# Altium project AttenuatorProto.PrjPCB
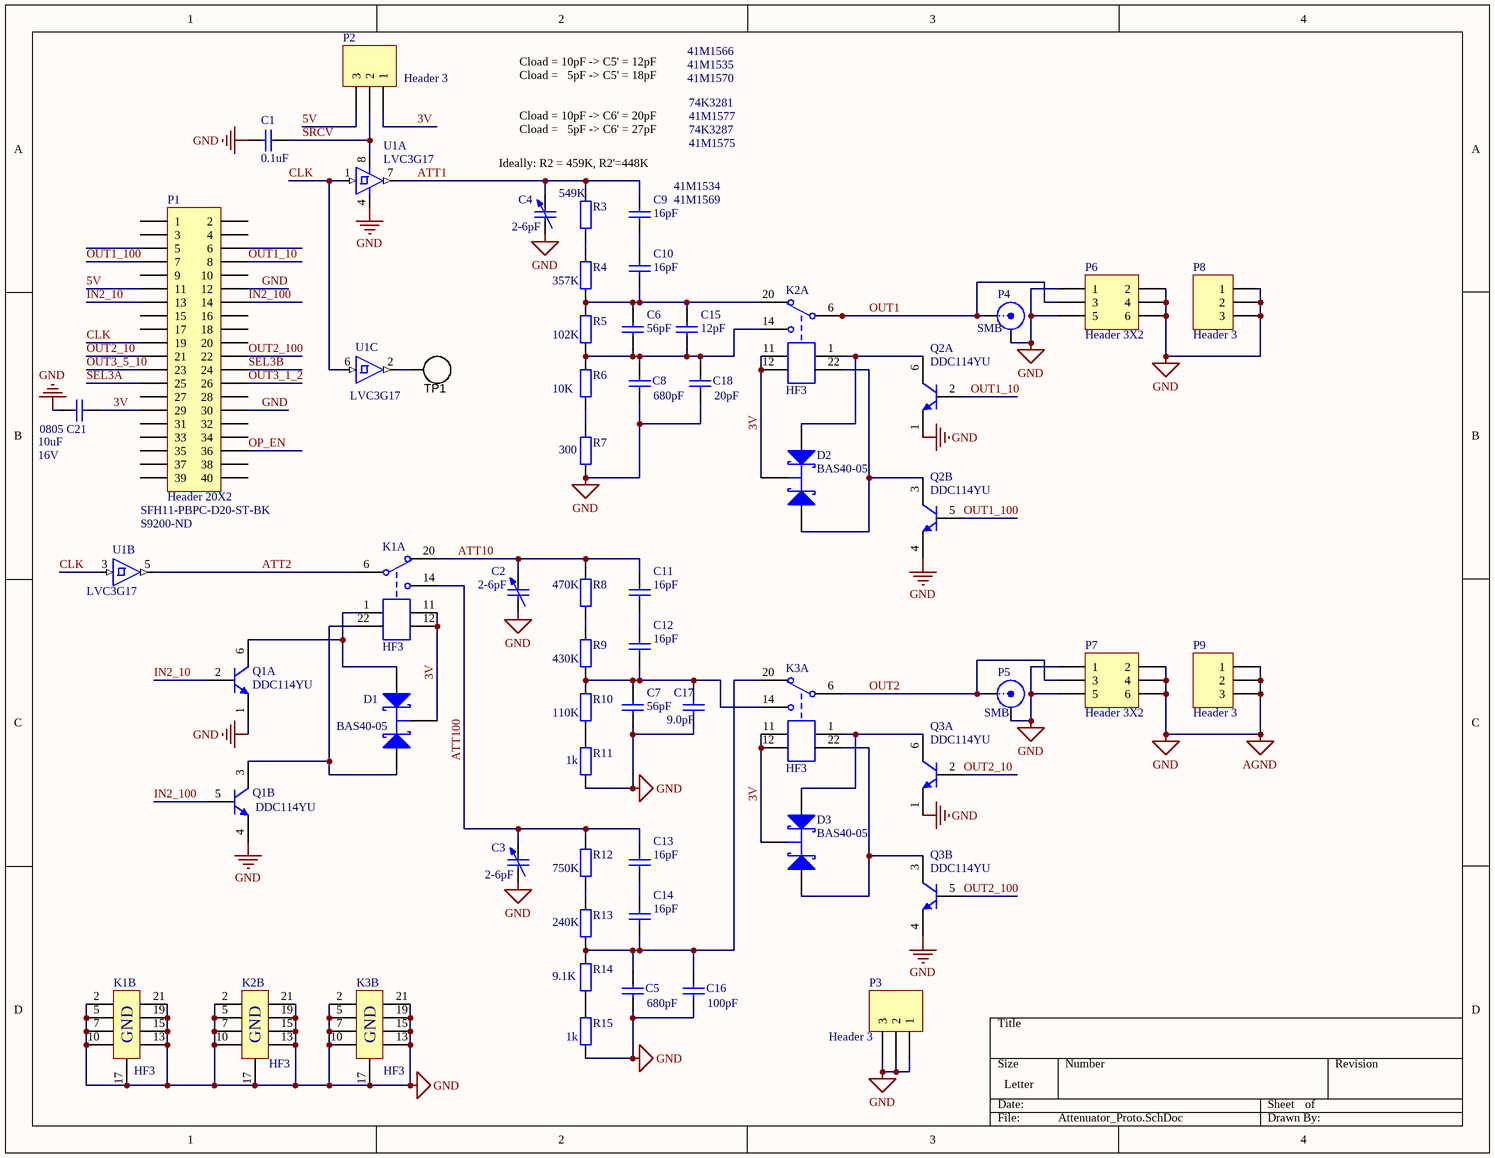
[diagram p0: Attenuator_Proto.SchDoc]
2 sheets, 101 parts. Net scope: global (net labels, ports and power ports of the same name join across sheets).
Board file: Attenuator_Proto.PcbDoc
Sheets:
  Attenuator_Proto.SchDoc
  Att_steet_1.SchDoc

## Sheet Attenuator_Proto.SchDoc
size Letter; DocumentNumber: 1; SheetNumber: 1; SheetTotal: 2

### Parts
C1  value 0.1uF  [C0805]  (hidden comment: Cap)
C2  value 2-6pF  [CAPC3225N]  (hidden comment: Cap Var)
C3  value 2-6pF  [CAPC3225N]  (hidden comment: Cap Var)
C4  value 2-6pF  [CAPC3225N]  (hidden comment: Cap Var)
C5  value 680pF  [c0805]  (hidden comment: Cap)
C6  value 56pF  [c0805]  (hidden comment: Cap)
C7  value 56pF  [c0805]  (hidden comment: Cap)
C8  value 680pF  [c0805]  (hidden comment: Cap)
C9  value 16pF  Supplier Part Number 1: 41M1569  Supplier Part Number 2: 41M1534  [c0805]  (hidden comment: Cap)
C10  value 16pF  [c0805]  (hidden comment: Cap)
C11  value 16pF  [c0805]  (hidden comment: Cap)
C12  value 16pF  [c0805]  (hidden comment: Cap)
C13  value 16pF  [c0805]  (hidden comment: Cap)
C14  value 16pF  [c0805]  (hidden comment: Cap)
C15  value 12pF  Supplier Part Number 2: 41M1570  Supplier Part Number 1: 41M1535  Supplier Part Number 3: 41M1566  [c0805]  (hidden comment: Cap)
C16  value 100pF  [c0805]  (hidden comment: Cap)
C17  value 9.0pF  [c0805]  (hidden comment: Cap)
C18  value 20pF  Supplier Part Number 1: 41M1575  Supplier Part Number 2: 74K3287  Supplier Part Number 3: 41M1577  Supplier Part Number 4: 74K3281  [c0805]  (hidden comment: Cap)
C21  value 10uF  PackageReference: 0805  Voltage: 16V  [CAPC2512L]  (hidden comment: Cap Semi)
D1  BAS40-05  [SOT-23]
D2  BAS40-05  [SOT-23]
D3  BAS40-05  [SOT-23]
K1  PartNumber: HF3  [HF3-75_Ohm]  (hidden comment: HF3_2coils_latching)  (parts A,B of 2)
K2  PartNumber: HF3  [HF3-75_Ohm]  (hidden comment: HF3_2coils_latching)  (parts A,B of 2)
K3  PartNumber: HF3  [HF3-75_Ohm]  (hidden comment: HF3_2coils_latching)  (parts A,B of 2)
P1  Header 20X2  PartNumber: SFH11-PBPC-D20-ST-BK  Supplier Part Number 1: S9200-ND  [HDR2X20]
P2  Header 3  [HDR1X3]
P3  Header 3  [HDR1X3]
P4  SMB  [SMB_V-RJ45]
P5  SMB  [SMB_V-RJ45]
P6  Header 3X2  [HDR2X3]
P7  Header 3X2  [HDR2X3]
P8  Header 3  [HDR1X3]
P9  Header 3  [HDR1X3]
Q1  PartNumber: DDC114YU  [SOT-363]  (hidden comment: DDCxxxxU)  (parts A,B of 2)
Q2  PartNumber: DDC114YU  [SOT-363]  (hidden comment: DDCxxxxU)  (parts A,B of 2)
Q3  PartNumber: DDC114YU  [SOT-363]  (hidden comment: DDCxxxxU)  (parts A,B of 2)
R3  value 549K  [0805]  (hidden comment: Res2)
R4  value 357K  [0805]  (hidden comment: Res2)
R5  value 102K  [0805]  (hidden comment: Res2)
R6  value 10K  [0805]  (hidden comment: Res2)
R7  value 300  [0805]  (hidden comment: Res2)
R8  value 470K  [0805]  (hidden comment: Res2)
R9  value 430K  [0805]  (hidden comment: Res2)
R10  value 110K  [0805]  (hidden comment: Res2)
R11  value 1k  [0805]  (hidden comment: Res2)
R12  value 750K  [0805]  (hidden comment: Res2)
R13  value 240K  [0805]  (hidden comment: Res2)
R14  value 9.1K  [0805]  (hidden comment: Res2)
R15  value 1k  [0805]  (hidden comment: Res2)
TP1  TESTPOINT  [TESTPOINT]  (value not drawn)  (no BOM)
U1  value LVC3G17  [sm8]  (hidden comment: SN74LVC3G17DCTR)  (parts A,B,C of 3)

### Nets
GND: C1.2 C2.1 C3.1 C4.1 C5.1 C7.1 C8.1 C16.1 C17.1 C18.1 C21.2 K1.2(GND) K1.5(GND) K1.7(GND) K1.10(GND) K1.13(GND) K1.15(GND) K1.17(GND) K1.19(GND) K1.21(GND) K2.2(GND) K2.5(GND) K2.7(GND) K2.10(GND) K2.13(GND) K2.15(GND) K2.17(GND) K2.19(GND) K2.21(GND) K3.2(GND) K3.5(GND) K3.7(GND) K3.10(GND) K3.13(GND) K3.15(GND) K3.17(GND) K3.19(GND) K3.21(GND) P1.12 P1.30 P3.1 P3.2 P3.3 P4.2(Y) P5.2(Y) P6.1 P6.2 P6.4 P6.5 P6.6 P7.1 P7.2 P7.4 P7.5 P7.6 P8.1 P8.2 P8.3 P9.1 P9.2 P9.3 Q1.1(E) Q1.4(E) Q2.1(E) Q2.4(E) Q3.1(E) Q3.4(E) R7.1 R11.1 R15.1 U1.4(GND)  [also labelled AGND]
3V: C21.1 D1.3(K) D2.3(K) D3.3(K) K1.11 K1.12 K2.11 K2.12 K3.11 K3.12 P1.29 P2.1
5V: P1.11 P2.3
ATT1: C4.2 C9.2 R3.2 U1.7(1Y)
ATT2: K1.6 U1.5(2Y)
ATT10: C2.2 C11.2 K1.20 R8.2
ATT100: C3.2 C13.2 K1.14 R12.2
CLK: P1.19 U1.1(1A) U1.3(2A) U1.6(3A)
IN2_10: P1.13 Q1.2(B)
IN2_100: P1.14 Q1.5(B)
OP_EN: P1.36
OUT1: K2.6 P4.1(X) P6.3
OUT1_10: P1.8 Q2.2(B)
OUT1_100: P1.7 Q2.5(B)
OUT2: K3.6 P5.1(X) P7.3
OUT2_10: P1.21 Q3.2(B)
OUT2_100: P1.22 Q3.5(B)
OUT3_1_2: P1.26
OUT3_5_10: P1.23
SEL3A: P1.25
SEL3B: P1.24
SRCV: C1.1 P2.2 U1.8(VCC)
NetC5_2: C5.2 C14.1 C16.2 K3.20 R13.1 R14.2
NetC6_1: C6.1 C8.2 C15.1 C18.2 K2.14 R5.1 R6.2
NetC6_2: C6.2 C10.1 C15.2 K2.20 R4.1 R5.2
NetC7_2: C7.2 C12.1 C17.2 K3.14 R9.1 R10.2
NetC9_1: C9.1 C10.2
NetC11_1: C11.1 C12.2
NetC13_1: C13.1 C14.2
NetD1_1: D1.1(A1) K1.1 Q1.6(C)
NetD1_2: D1.2(A2) K1.22 Q1.3(C)
NetD2_1: D2.1(A1) K2.1 Q2.6(C)
NetD2_2: D2.2(A2) K2.22 Q2.3(C)
NetD3_1: D3.1(A1) K3.1 Q3.6(C)
NetD3_2: D3.2(A2) K3.22 Q3.3(C)
NetR3_1: R3.1 R4.2
NetR6_1: R6.1 R7.2
NetR8_1: R8.1 R9.2
NetR10_1: R10.1 R11.2
NetR12_1: R12.1 R13.2
NetR14_1: R14.1 R15.2
NetTP1_1: TP1.1 U1.2(3Y)

Not connected (* = marked no-connect by the designer): P1 1 2 3 4 5 6 9 10 15 16 17 18 20 27 28 31 32 33 34 35 37 38 39 40

### Notes on the sheet
- Cload = 10pF -> C5' = 12pF
  Cload =   5pF -> C5' = 18pF
- Ideally: R2 = 459K, R2'=448K
- Cload = 10pF -> C6' = 20pF
  Cload =   5pF -> C6' = 27pF

### Library data of the parts
C1 C5-C18 = Cap: Capacitor; Published: 8-Jun-2000; LatestRevisionDate: 17-Jul-2002; LatestRevisionNote: Re-released for DXP Platform.; PackageReference: RAD-0.3; Publisher: Altium Limited
  C1: Supplier 1: Newark; Supplier Part Number 1: 06R3744
  C5 C8: Supplier 1: Newark; Supplier Part Number 1: 46WX121
  C6 C7: Supplier 1: Newark; Supplier Part Number 1: 41M1546
  C9: Supplier 1: Newark; Supplier 2: Newark
  C10-C14: Supplier 1: Newark; Supplier Part Number 1: 41M1569; Supplier 2: Newark; Supplier Part Number 2: 41M1534
  C15: Supplier 1: Newark; Supplier 2: Newark; Supplier 3: Newark
  C18: Supplier 1: Newark; Supplier 2: Newark; Supplier 3: Newark; Supplier 4: Newark
C2-C4 = Cap Var: Variable or Adjustable Capacitor; Published: 24-Mar-1999; LatestRevisionDate: 29-May-2009; LatestRevisionNote: IPC-7351 Footprint Added.; PackageReference: C1210; Publisher: Altium Limited; PackageDescription: Chip Capacitor 1210 Case Size; Code_JEITA: 1210; Code_IPC: CAPC3225; Supplier 1: Digi-Key; Supplier Part Number 1: 490-2001-1-ND
C21 = Cap Semi: Capacitor (Semiconductor SIM Model); Manufacturer: Murata; PartNumber: GRM21BF51C106ZE15L; Published: 8-Jun-2000; LatestRevisionDate: 29-May-2009; LatestRevisionNote: IPC-7351 Footprint Added.; Publisher: Altium Limited; PackageDescription: Chip Capacitor; RoHS: Yes; CompType: Cap; Supplier 1: Digi-Key; Supplier Part Number 1: 490-3347-1-ND
D1-D3 = BAS40-05: Silicon AF Schottky Diode for High-Speed Switching; Published: 21-Mar-2003; DatasheetDocument: Oct-1999; PackageDocument: Sep-2001; PackageReference: SOT-23; Publisher: Altium Limited; ComponentLink1Description: Manufacturer Link; ComponentLink1URL: http://www.infineon.com/; ComponentLink2Description: Datasheet; ComponentLink2URL: http://www.infineon.com/upload/Document/cmc_upload/documents/037/109/bas40_bas140series.pdf
K1-K3 = HF3_2coils_latching: HF3 Relay, Latching type, 2 coils; Manufacturer: Tyco Electronics
P1 = Header 20X2: Header, 20-Pin, Dual row; LatestRevisionDate: 17-Jul-2002; LatestRevisionNote: Re-released for DXP Platform.; Publisher: Altium Limited; Supplier 1: Digi-Key
P2 P3 P8 P9 = Header 3: Header, 3-Pin; LatestRevisionDate: 17-Jul-2002; LatestRevisionNote: Re-released for DXP Platform.; Publisher: Altium Limited
P4 P5 = SMB: SMB Straight Connector; LatestRevisionDate: 17-Jul-2002; LatestRevisionNote: Re-released for DXP Platform.; Publisher: Altium Limited
P6 P7 = Header 3X2: Header, 3-Pin, Dual row; LatestRevisionDate: 17-Jul-2002; LatestRevisionNote: Re-released for DXP Platform.; Publisher: Altium Limited
Q1-Q3 = DDCxxxxU: NPN PRE-BIASED SMALL SIGNAL DUAL SURFACE MOUNT TRANSISTOR; Supplier 2: Digi-Key; Supplier Part Number 2: DDC114YU-FDICT-ND; Supplier 1: Avnet; Supplier Part Number 1: DDC114YU-7-F/BKN
R3-R15 = Res2: Resistor; Published: 8-Jun-2000; LatestRevisionDate: 17-Jul-2002; LatestRevisionNote: Re-released for DXP Platform.; PackageReference: AXIAL-0.4; Publisher: Altium Limited
  R3: Supplier 1: Digi-Key; Supplier Part Number 1: RR12P549KDCT-ND
  R4: Supplier 1: Digi-Key; Supplier Part Number 1: RR08P357KDCT-ND
  R5: Supplier 1: Digi-Key; Supplier Part Number 1: RG20P102KBCT-ND; Supplier 2: Digi-Key; Supplier Part Number 2: RR08P102KDCT-ND
  R6: Supplier 1: Digi-Key; Supplier Part Number 1: RR12P10.0KDDKR-ND
  R7: Supplier 1: Digi-Key; Supplier Part Number 1: RR12P300DCT-ND
  R8: Supplier 1: Digi-Key; Supplier Part Number 1: RR12P470KDCT-ND
  R9: Supplier 1: Digi-Key; Supplier Part Number 1: P430KCCT-ND
  R10: Supplier 1: Digi-Key; Supplier Part Number 1: RR1220P-114-D
  R11: Supplier 1: Digi-Key; Supplier Part Number 1: ERJ-6ENF1001V
  R12: Supplier 1: Digi-Key; Supplier Part Number 1: RR1220P-754-D
  R13: Supplier 1: Digi-Key; Supplier Part Number 1: RR1220P-244-D; Supplier 2: Digi-Key; Supplier Part Number 2: RR12P240KDCT-ND
  R14: Supplier 2: Digi-Key; Supplier Part Number 2: RR12P9.1KDCT-ND
  R15: Supplier 1: Digi-Key; Supplier Part Number 1: ERJ-6ENF1001V; Supplier 2: Digi-Key; Supplier Part Number 2: P1.00KCCT-ND
TP1 = TESTPOINT: TEST POINT.  No entry in BOM.; SymbolVersion: 2009-02-23; CompType: Testpoint; Manufacturer: *; PartNumber: *; RoHS: Yes; CompType: *
U1 = SN74LVC3G17DCTR: Manufacturer: Texas Instruments; Supplier 1: Newark; Supplier 2: Digi-Key; Supplier Part Number 1: 90H3713; Supplier Part Number 2: 296-16915-1-ND; Manufacturer Part Number: SN74LVC3G17DCTR

## Sheet Att_steet_1.SchDoc
size A; DocumentNumber: 1; SheetNumber: 2; SheetTotal: 2
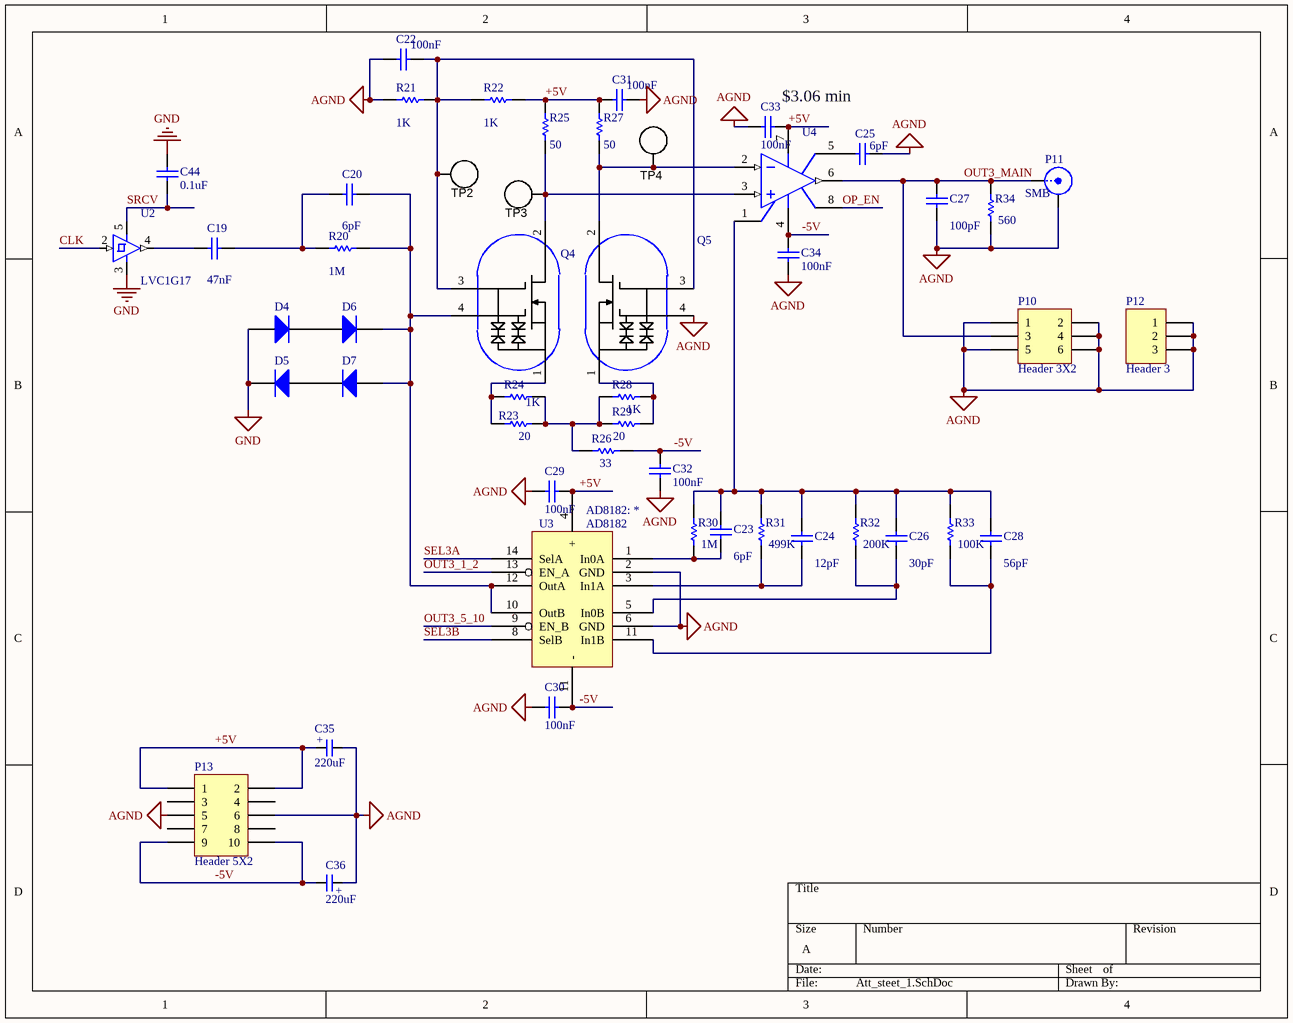
[diagram p1: Att_steet_1.SchDoc]

### Parts
C19  value 47nF  [0805]  (hidden comment: C0805)
C20  value 6pF  [0805]  (hidden comment: C0805)
C22  value 100nF  [0805]  (hidden comment: C0805)
C23  value 6pF  [0805]  (hidden comment: C0805)
C24  value 12pF  [0805]  (hidden comment: C0805)
C25  value 6pF  [CAPC3216L]  (hidden comment: Cap Semi)
C26  value 30pF  [0805]  (hidden comment: C0805)
C27  value 100pF  [0805]  (hidden comment: C0805)
C28  value 56pF  [0805]  (hidden comment: C0805)
C29  value 100nF  [0805]  (hidden comment: C0805)
C30  value 100nF  [0805]  (hidden comment: C0805)
C31  value 100nF  [0805]  (hidden comment: C0805)
C32  value 100nF  [0805]  (hidden comment: C0805)
C33  value 100nF  [0805]  (hidden comment: C0805)
C34  value 100nF  [0805]  (hidden comment: C0805)
C35  value 220uF  [H13]  (hidden comment: Cap)
C36  value 220uF  [H13]  (hidden comment: Cap)
C44  value 0.1uF  [C0805]  (hidden comment: Cap)
D4  Diode BAS21  [SOT95P240-3N]  (value not drawn)
D5  Diode BAS21  [SOT95P240-3N]  (value not drawn)
D6  Diode BAS21  [SOT95P240-3N]  (value not drawn)
D7  Diode BAS21  [SOT95P240-3N]  (value not drawn)
P10  Header 3X2  [HDR2X3]
P11  SMB  [SMB_V-RJ45]
P12  Header 3  [HDR1X3]
P13  Header 5X2  [HDR2X5]
Q4  MOSFET  [SOT143]  (value not drawn)
Q5  MOSFET  [SOT143]  (value not drawn)
R20  value 1M  [0805]  (hidden comment: ERA6Y)
R21  value 1K  [0805]  (hidden comment: ERA6Y)
R22  value 1K  [0805]  (hidden comment: ERA6Y)
R23  value 20  [0805]  (hidden comment: ERA6Y)
R24  value 1K  [0805]  (hidden comment: ERA6Y)
R25  value 50  [0805]  (hidden comment: ERA6Y)
R26  value 33  [0805]  (hidden comment: ERA6Y)
R27  value 50  [0805]  (hidden comment: ERA6Y)
R28  value 1K  [0805]  (hidden comment: ERA6Y)
R29  value 20  [0805]  (hidden comment: ERA6Y)
R30  value 1M  [0805]  (hidden comment: ERA6Y)
R31  value 499K  [0805]  (hidden comment: ERA6Y)
R32  value 200K  [0805]  (hidden comment: ERA6Y)
R33  value 100K  [0805]  (hidden comment: ERA6Y)
R34  value 560  [0805]  (hidden comment: ERA6Y)
TP2  TESTPOINT  [TESTPOINT]  (value not drawn)  (no BOM)
TP3  TESTPOINT  [TESTPOINT]  (value not drawn)  (no BOM)
TP4  TESTPOINT  [TESTPOINT]  (value not drawn)  (no BOM)
U2  value LVC1G17  [SC_70_5]  (hidden comment: SN74LVC1G17)
U3  AD8182  [SO14]
U4  AD707AR  [SO-8_N]  (value not drawn)

### Nets
GND: C22.1 C25.2 C27.1 C29.2 C30.2 C31.2 C32.1 C33.2 C34.1 C35.2 C36.1 C44.2 D4.1(A) D5.3(K) P10.1 P10.2 P10.4 P10.5 P10.6 P11.2(Y) P12.1 P12.2 P12.3 P13.5 P13.6 Q5.4 R21.2 R34.1 U2.3(GND) U3.2(GND) U3.6(GND)  [also labelled AGND]
+5V: C29.1 C31.1 C33.1 C35.1 P13.1 P13.2 R22.1 R25.1 R27.1 U3.4(+) U4.7(V+)
-5V: C30.1 C32.2 C34.2 C36.2 P13.9 P13.10 R26.1 U3.11(-) U4.4(V-)
CLK: U2.2(1A)
OP_EN: U4.8(NULL2)
OUT3_1_2: U3.13(EN_A)
OUT3_5_10: U3.9(EN_B)
OUT3_MAIN: C27.2 P10.3 P11.1(X) R34.2 U4.6(OUT)
SEL3A: U3.14(SelA)
SEL3B: U3.8(SelB)
SRCV: C44.1 U2.5(VCC)
NetC19_1: C19.1 U2.4(1Y)
NetC19_2: C19.2 C20.1 R20.2
NetC20_2: C20.2 D6.3(K) D7.1(A) Q4.4 R20.1 U3.10(OutB) U3.12(OutA)
NetC22_2: C22.2 Q4.3 Q5.3 R21.1 R22.2 TP2.1
NetC23_1: C23.1 R30.1 U3.1(In0A)
NetC23_2: C23.2 C24.2 C26.2 C28.2 R30.2 R31.2 R32.2 R33.2 U4.1(NULL1)
NetC24_1: C24.1 R31.1 U3.3(In1A)
NetC25_1: C25.1 U4.5(NC)
NetC26_1: C26.1 R32.1 U3.5(In0B)
NetC28_1: C28.1 R33.1 U3.11(In1B)
NetD4_3: D4.3(K) D6.1(A)
NetD5_1: D5.1(A) D7.3(K)
NetQ4_1: Q4.1 R23.2 R24.2
NetQ4_2: Q4.2 R25.2 TP3.1 U4.3(IN+)
NetQ5_1: Q5.1 R28.1 R29.1
NetQ5_2: Q5.2 R27.2 TP4.1 U4.2(IN-)
NetR23_1: R23.1 R24.1 R26.2 R28.2 R29.2

Not connected (* = marked no-connect by the designer): P13 3 4 7 8

### Notes on the sheet
- (near C33) $3.06 min
- (in symbol Lyt Cap) +

### Library data of the parts
C19 C20 C22-C24 C26-C34 = C0805: Ceramic Chip Capacitor - Standard; Note: Footprint corresponds to dimensions for bulk cassette packaging. This case size has tightened tolerances.; Published: 17-Jul-2002; LatestRevisionDate: 19-Mar-2004; LatestRevisionNote: Silkscreen size reduced.; DatasheetDocument: Mar-2001; PackageDocument: Mar-2001; PackageReference: 0805; Publisher: Altium Limited; Code_JEITA: 0805; Code_IPC: 2012[0805]; ComponentLink1Description: Manufacturer Link; ComponentLink1URL: http://www.kemet.com/; ComponentLink2Description: Datasheet; ComponentLink2URL: http://www.kemet.com/kemet/web/homepage/kechome.nsf/vapubfilesname/F3102TA.pdf/$file/F3102TA.pdf
C25 = Cap Semi: Capacitor (Semiconductor SIM Model); Published: 8-Jun-2000; LatestRevisionDate: 29-May-2009; LatestRevisionNote: IPC-7351 Footprint Added.; PackageReference: C1206; Publisher: Altium Limited; PackageDescription: Chip Capacitor
C35 C36 = Lyt Cap: Manufacturer: Panasonic; Type: Aluminum Lyt Cap
C44 = Cap: Capacitor; Published: 8-Jun-2000; LatestRevisionDate: 17-Jul-2002; LatestRevisionNote: Re-released for DXP Platform.; PackageReference: RAD-0.3; Publisher: Altium Limited; Supplier 1: Newark; Supplier Part Number 1: 06R3744
D4-D7 = Diode BAS21: Silicon Switching Diode for High-Speed, High-Voltage Switching; Note: Pin 2 is not connected and not drawn.; Published: 21-Mar-2003; LatestRevisionDate: 29-May-2009; LatestRevisionNote: IPC-7351 Footprint Added.; DatasheetVersion: Oct-1999; PackageVersion: Sep-2001; PackageReference: SOT-23; Publisher: Altium Limited; PackageDescription: 3-Pin SOT-23 Package 0.95 mm Pitch, 2.5 mm Lead Span; ComponentLink1Description: Manufacturer Link; ComponentLink1URL: http://www.infineon.com/; ComponentLink2Description: Datasheet; ComponentLink2URL: http://www.infineon.com/upload/Document/cmc_upload/documents/080/812/bas21series.pdf
P10 = Header 3X2: Header, 3-Pin, Dual row; LatestRevisionDate: 17-Jul-2002; LatestRevisionNote: Re-released for DXP Platform.; Publisher: Altium Limited
P11 = SMB: SMB Straight Connector; LatestRevisionDate: 17-Jul-2002; LatestRevisionNote: Re-released for DXP Platform.; Publisher: Altium Limited
P12 = Header 3: Header, 3-Pin; LatestRevisionDate: 17-Jul-2002; LatestRevisionNote: Re-released for DXP Platform.; Publisher: Altium Limited
P13 = Header 5X2: Header, 5-Pin, Dual row; LatestRevisionDate: 17-Jul-2002; LatestRevisionNote: Re-released for DXP Platform.; Publisher: Altium Limited
Q4 = BF998: Dual-gate MOSFET; Manufacturer: NXP; Layout variant: Regular; Distibutor 1: Mouser
Q5 = BF998: Dual-gate MOSFET; Manufacturer: NXP; Layout variant: Regular
R20-R34 = ERA6Y: Rectangular Thick Film Chip Resistor, 10 Ohm to 1M Ohm Range, 0.1% and 0.5% Tolerance, 0805 Size, 0.1 W; Note: If flow soldering, adjust pad width of PCB Footprint to 0.7 - 0.8 times the width of the resistor.; Published: 17-Dec-2003; LatestRevisionDate: 19-Mar-2004; LatestRevisionNote: Silkscreen size reduced.; Publisher: Altium Limited; PackageDocument: Mar-2003; Code_IPC: 2012 [0805]; ComponentLink1Description: Manufacturer Link; ComponentLink1URL: http://www.panasonic.com/industrial/components/resistive_products.htm; ComponentLink2Description: Datasheet; ComponentLink2URL: http://www.panasonic.com/industrial/components/pdf/AOA0000CE8.pdf
  R20-R24 R26-R34: PackageReference: ERA-0805
  R25: PackageReference: 0805
TP2-TP4 = TESTPOINT: TEST POINT.  No entry in BOM.; SymbolVersion: 2009-02-23; CompType: Testpoint; Manufacturer: *; PartNumber: *; RoHS: Yes; CompType: *
U2 = SN74LVC1G17: Manufacturer: Texas Instruments; Manufacturer Part Number: SN74LVC1G17DCKR; CompType: Buffer IC; Supplier 1: Newark; Supplier 2: Digi-Key; Supplier Part Number 1: 26M3321; Supplier Part Number 2: 296-11934-1-ND
U3 = AD8182: Dual 2X1 RF switch; Manufacturer: Analog Devices; AD8182: *
U4 = AD707AR: Ultra-Low Drift Operational Amplifier; PartNumber: AD8099; Note: Pin 5 is not connected.; ComponentAvailability: Obsolete; Published: 8-Jun-2000; LatestRevisionDate: 13-Apr-2006; LatestRevisionNote: IPC-7351 Footprint Added.; DatasheetVersion: REV. B 1995; PackageVersion: revA; PackageReference: SO-8; Publisher: Altium Limited; PackageDescription: 8-Pin Small Outline Integrated Circuit 1.27 mm Pitch; Code_JEDEC: MS-012-AA; Code_IPC: SOIC127P600-8; ComponentLink1Description: Manufacturer Link; ComponentLink1URL: http://www.analog.com/; ComponentLink2Description: Datasheet; ComponentLink2URL: http://www.analog.com/UploadedFiles/Obsolete_Data_Sheets/2143387AD707.pdf

## Nets that join several sheets
GND: Attenuator_Proto (71 pins), Att_steet_1 (31 pins)
CLK: Attenuator_Proto (P1.19 U1.1 U1.3 U1.6), Att_steet_1 (U2.2)
OP_EN: Attenuator_Proto (P1.36), Att_steet_1 (U4.8)
OUT3_1_2: Attenuator_Proto (P1.26), Att_steet_1 (U3.13)
OUT3_5_10: Attenuator_Proto (P1.23), Att_steet_1 (U3.9)
SEL3A: Attenuator_Proto (P1.25), Att_steet_1 (U3.14)
SEL3B: Attenuator_Proto (P1.24), Att_steet_1 (U3.8)
SRCV: Attenuator_Proto (C1.1 P2.2 U1.8), Att_steet_1 (C44.1 U2.5)